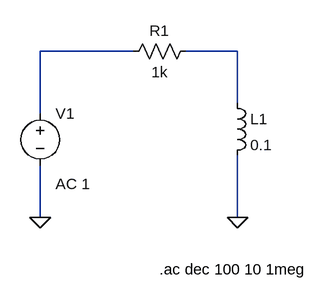
[diagram p0: schematic High pass filter.asc]
High pass filter.asc, the LTspice schematic file:
Version 4
SHEET 1 880 680
WIRE 192 -48 48 -48
WIRE 352 -48 272 -48
WIRE 352 32 352 -48
WIRE 48 48 48 -48
WIRE 48 208 48 128
WIRE 352 208 352 112
FLAG 48 208 0
FLAG 352 208 0
SYMBOL voltage 48 32 R0
WINDOW 123 24 124 Left 2
WINDOW 39 0 0 Left 0
SYMATTR Value2 AC 1
SYMATTR InstName V1
SYMATTR Value ""
SYMBOL res 288 -64 R90
WINDOW 0 0 56 VBottom 2
WINDOW 3 32 56 VTop 2
SYMATTR InstName R1
SYMATTR Value 1k
SYMBOL ind 336 16 R0
SYMATTR InstName L1
SYMATTR Value 0.1
TEXT 232 288 Left 2 !.ac dec 100 10 1meg

The netlist it stands for:
* High pass filter.asc
V1 N001 0 AC 1
R1 N002 N001 1k
L1 N002 0 0.1
.ac dec 100 10 1meg
.backanno
.end